# Altium project Sound_Pops.PrjPcb
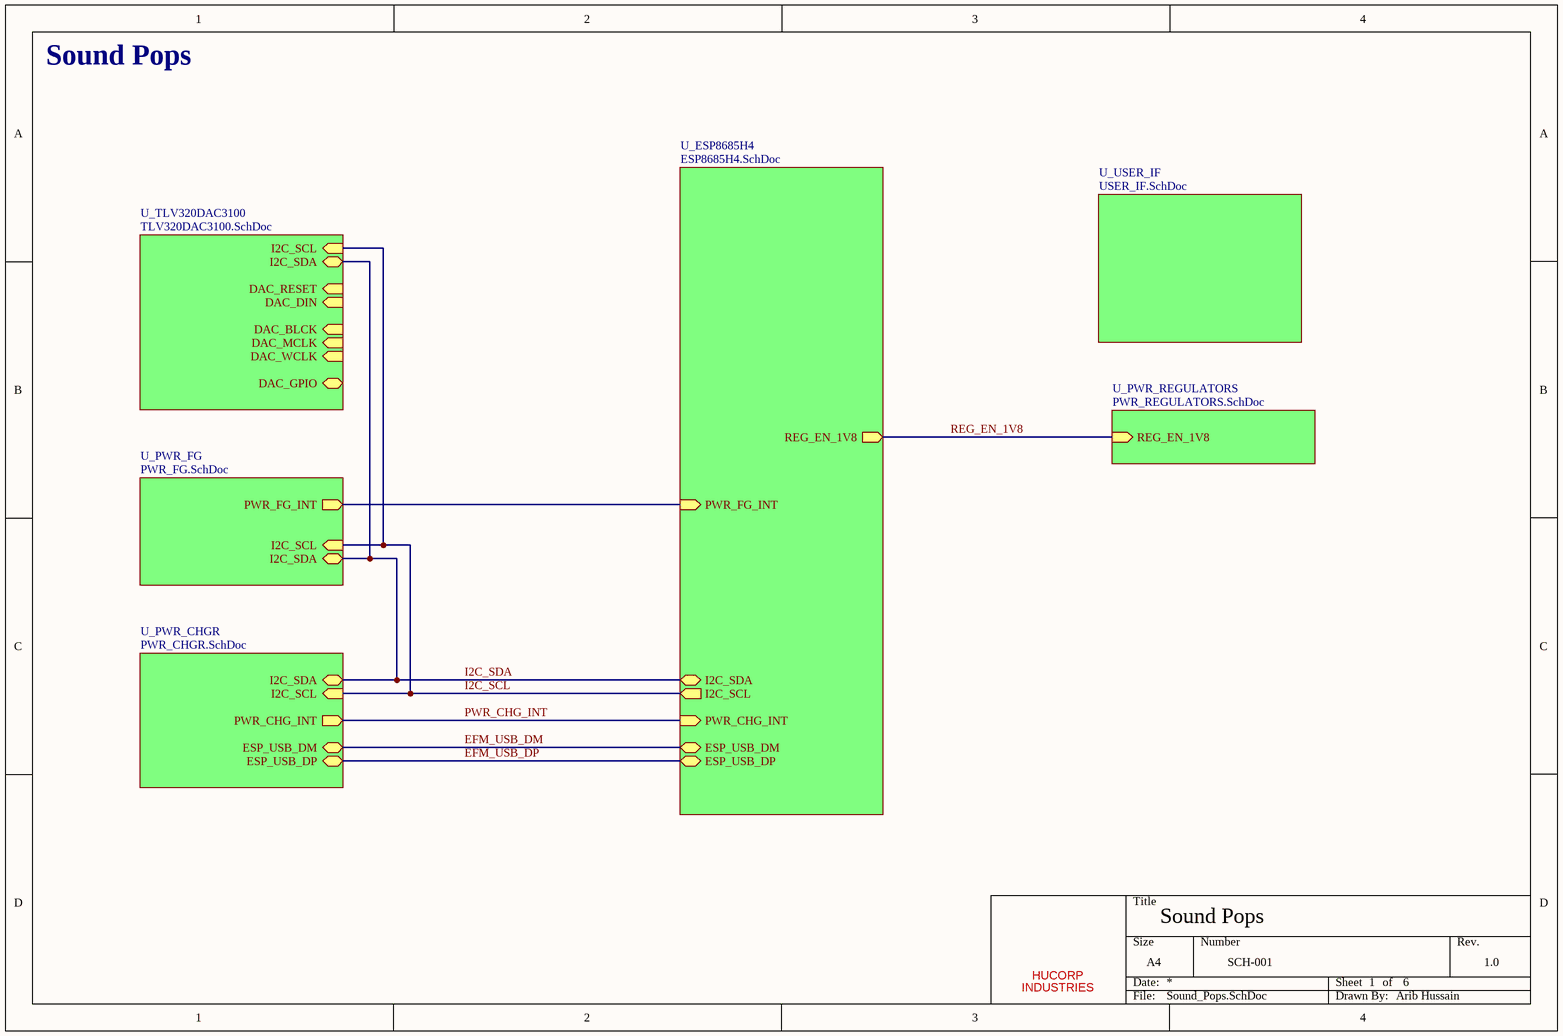
[diagram p0: Sound_Pops.SchDoc]
DrawnBy: Arib Hussain; Revision: 1.0; Title: Sound Pops
7 sheets, 82 parts. Net scope: hierarchical (ports join the sheet entries above them; power ports are global).
Sheets:
  Sound_Pops.SchDoc
    U_ESP8685H4 = ESP8685H4.SchDoc
    U_PWR_REGULATORS = PWR_REGULATORS.SchDoc
    U_USER_IF = USER_IF.SchDoc
    U_TLV320DAC3100 = TLV320DAC3100.SchDoc
    U_PWR_FG = PWR_FG.SchDoc
    U_PWR_CHGR = PWR_CHGR.SchDoc

## Sheet Sound_Pops.SchDoc: Sound Pops
size A4; SheetNumber: 1; SheetTotal: 6; DrawingNumber: SCH-001; SheetSize: A4

### Parts
(Parts that share a designator on the sheet are numbered #1, #2 ... from top to bottom, then left to right.)
*#1  HUCORP  (value not drawn)  (graphical)

### Sub-sheets
U_ESP8685H4 = ESP8685H4.SchDoc: ESP_USB_DM (bidir), ESP_USB_DP (bidir), I2C_SCL (out), I2C_SDA (bidir), PWR_CHG_INT (in), REG_EN_1V8 (out), PWR_FG_INT (in)
U_PWR_CHGR = PWR_CHGR.SchDoc: ESP_USB_DP (bidir), I2C_SCL (in), I2C_SDA (bidir), ESP_USB_DM (bidir), PWR_CHG_INT (out)
U_PWR_FG = PWR_FG.SchDoc: I2C_SDA (bidir), I2C_SCL (in), PWR_FG_INT (out)
U_PWR_REGULATORS = PWR_REGULATORS.SchDoc: REG_EN_1V8 (in)
U_TLV320DAC3100 = TLV320DAC3100.SchDoc: I2C_SDA (bidir), I2C_SCL (in), DAC_RESET (in), DAC_BLCK (in), DAC_DIN (in), DAC_MCLK (in), DAC_WCLK (in), DAC_GPIO (bidir)
U_USER_IF = USER_IF.SchDoc: no entries

### Nets
EFM_USB_DM: sheet U_ESP8685H4/ESP_USB_DM, sheet U_PWR_CHGR/ESP_USB_DM
EFM_USB_DP: sheet U_ESP8685H4/ESP_USB_DP, sheet U_PWR_CHGR/ESP_USB_DP
I2C_SCL: sheet U_ESP8685H4/I2C_SCL, sheet U_TLV320DAC3100/I2C_SCL, sheet U_PWR_FG/I2C_SCL, sheet U_PWR_CHGR/I2C_SCL
I2C_SDA: sheet U_ESP8685H4/I2C_SDA, sheet U_TLV320DAC3100/I2C_SDA, sheet U_PWR_FG/I2C_SDA, sheet U_PWR_CHGR/I2C_SDA
PWR_CHG_INT: sheet U_ESP8685H4/PWR_CHG_INT, sheet U_PWR_CHGR/PWR_CHG_INT
PWR_FG_INT: sheet U_ESP8685H4/PWR_FG_INT, sheet U_PWR_FG/PWR_FG_INT
REG_EN_1V8: sheet U_ESP8685H4/REG_EN_1V8, sheet U_PWR_REGULATORS/REG_EN_1V8  [project net 1V8_EN]

### Notes on the sheet
- Sound Pops
- (in symbol TitleBlock1) Title; Size; Number; Rev.; INDUSTRIES; Date:; Sheet; of; File:; Drawn By:

### Library data of the parts
*#1 = TitleBlock1: HUCORP Title Block

## Sheet ESP8685H4.SchDoc: Sound Pops
size A4; SheetNumber: 2; SheetTotal: 7; SheetSize: A4; DrawingNumber: SCH-001
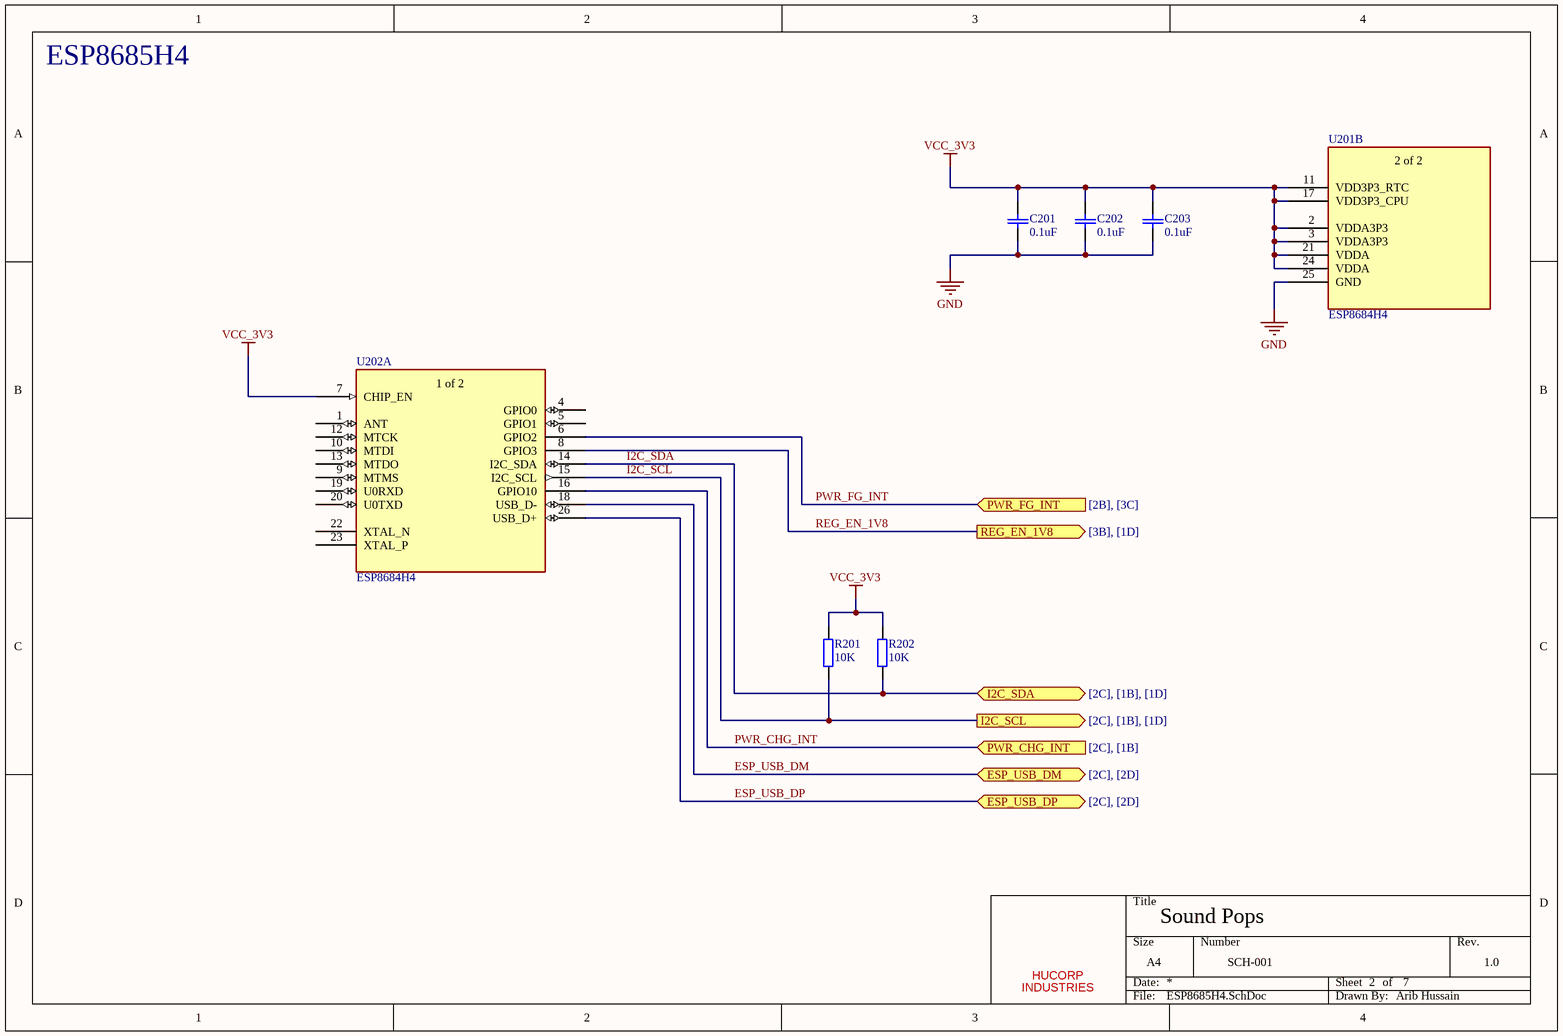
[diagram p1: ESP8685H4.SchDoc]

### Parts
(Parts that share a designator on the sheet are numbered #1, #2 ... from top to bottom, then left to right.)
*#2  HUCORP  (value not drawn)  (graphical)
C201  value 0.1uF  [CAP_CL10_SAM]  (hidden comment: 100 nF)
C202  value 0.1uF  [CAP_CL10_SAM]  (hidden comment: 100 nF)
C203  value 0.1uF  [CAP_CL10_SAM]  (hidden comment: 100 nF)
R201  10K  [RES_RC0603_YAG]
R202  10K  [RES_RC0603_YAG]
U201  ESP8684H4  [QFN24_4X4_EXP]  (part B of 2)
U202  ESP8684H4  [QFN24_4X4_EXP]  (part A of 2)

### Ports
ESP_USB_DM (bidir, see [2C], [2D]), ESP_USB_DP (bidir, see [2C], [2D]), I2C_SCL (out, see [2C], [1B], [1D]), I2C_SDA (bidir, see [2C], [1B], [1D]), PWR_CHG_INT (in, see [2C], [1B]), PWR_FG_INT (in, see [2B], [3C]), REG_EN_1V8 (out, see [3B], [1D])

### Nets
GND: C201.1 C202.1 C203.1 U201.25(GND)
VCC_3V3: C201.2 C202.2 C203.2 R201.2 R202.2 U201.2(VDDA3P3) U201.3(VDDA3P3) U201.11(VDD3P3_RTC) U201.17(VDD3P3_CPU) U201.21(VDDA) U201.24(VDDA) U202.7(CHIP_EN)
ESP_USB_DM: U202.18(USB_D-) ; port ESP_USB_DM  [project net EFM_USB_DM]
ESP_USB_DP: U202.26(USB_D+) ; port ESP_USB_DP  [project net EFM_USB_DP]
I2C_SCL: R201.1 U202.15(I2C_SCL) ; port I2C_SCL
I2C_SDA: R202.1 U202.14(I2C_SDA) ; port I2C_SDA
PWR_CHG_INT: U202.16(GPIO10) ; port PWR_CHG_INT
PWR_FG_INT: U202.6(GPIO2) ; port PWR_FG_INT
REG_EN_1V8: U202.8(GPIO3) ; port REG_EN_1V8  [project net 1V8_EN]

Not connected (* = marked no-connect by the designer): U202 1(ANT) 4(GPIO0) 5(GPIO1) 9(MTMS) 10(MTDI) 12(MTCK) 13(MTDO) 19(U0RXD) 20(U0TXD) 22(XTAL_N) 23(XTAL_P)

### Notes on the sheet
- ESP8685H4
- (in symbol ESP8684H4, part A) 1 of 2
- (in symbol ESP8684H4, part B) 2 of 2
- (in symbol TitleBlock1) Title; Size; Number; Rev.; INDUSTRIES; Date:; Sheet; of; File:; Drawn By:

### Library data of the parts
*#2 = TitleBlock1: HUCORP Title Block
C201-C203 = CL10B104KA8NNNC: CAP CER 0.1UF 25V X7R 0603; Mfr_Name: Samsung; Type: DEV; Copyright: Copyright (C) 2022 Ultra Librarian. All rights reserved.; Manufacturer_Part_Number: CL10B104KA8NNNC; Digi-Key_Part_Number_1: 1276-1006-2-ND; Digi-Key_Part_Number_2: 1276-1006-1-ND; Digi-Key_Part_Number_3: 1276-1006-6-ND; RefDes: RefDes
R201 R202 = RC0603JR-1310KL: RES 10K OHM 5% 1/10W 0603; Mfr_Name: Yageo; Copyright: Copyright (C) 2022 Ultra Librarian. All rights reserved.; Manufacturer_Part_Number: RC0603JR-1310KL; Digi-Key_Part_Number_1: 13-RC0603JR-1310KLTR-ND; Digi-Key_Part_Number_2: 13-RC0603JR-1310KLCT-ND; Digi-Key_Part_Number_3: 13-RC0603JR-1310KLDKR-ND; RefDes: RefDes; Type: DEV; Value: 10K
U201 U202 = ESP8684H4: IC RF TxRx + MCU Bluetooth, WiFi 802.11b/g/n, Bluetooth v5.0 2.4GHz 28-VFQFN Exposed Pad; Mfr_Name: Espressif Systems; Manufacturer_Part_Number: ESP8684H2; Copyright: Copyright (C) 2023 Ultra Librarian. All rights reserved.; RefDes: RefDes; Type: DEV

## Sheet PWR_REGULATORS.SchDoc: Sound Pops
size A4; SheetNumber: 5; SheetTotal: 7; DrawingNumber: 1.0; SheetSize: A4
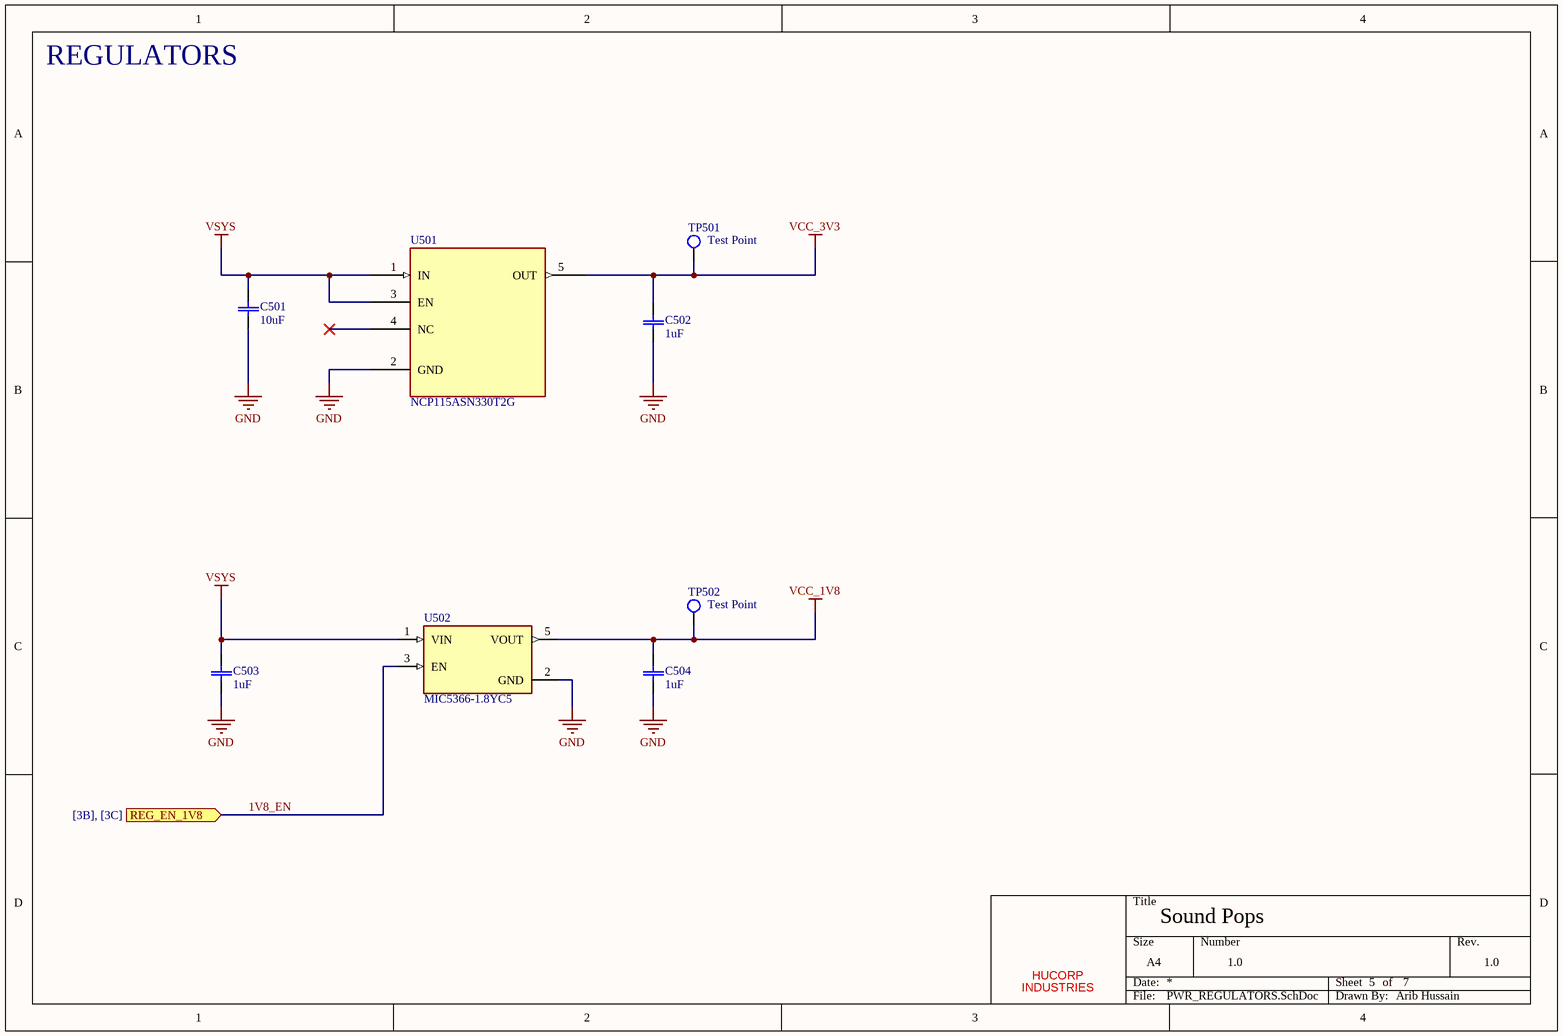
[diagram p2: PWR_REGULATORS.SchDoc]

### Parts
(Parts that share a designator on the sheet are numbered #1, #2 ... from top to bottom, then left to right.)
*#3  HUCORP  (value not drawn)  (graphical)
C501  value 10uF  [CAP_CL10_SAM]  (hidden comment: 10 uF)
C502  1uF  [CAP_CL10_SAM]
C503  1uF  [CAP_CL10_SAM]
C504  1uF  [CAP_CL10_SAM]
TP501  Test Point  [TestPoint1]  (no BOM)
TP502  Test Point  [TestPoint1]  (no BOM)
U501  NCP115ASN330T2G  [TSOP-5-483-N_ONS]
U502  MIC5366-1.8YC5  [SOT65P210X110-5N]

### Ports
REG_EN_1V8 (in, see [3B], [3C])

### Nets
GND: C501.1 C502.1 C503.1 C504.1 U501.2(GND) U502.2(GND)
VCC_1V8: C504.2 TP502.1 U502.5(VOUT)
VCC_3V3: C502.2 TP501.1 U501.5(OUT)
VSYS: C501.2 C503.2 U501.1(IN) U501.3(EN) U502.1(VIN)
1V8_EN: U502.3(EN) ; port REG_EN_1V8

Not connected (* = marked no-connect by the designer): U501 4(NC)*

### Notes on the sheet
- REGULATORS
- (in symbol TitleBlock1) Title; Size; Number; Rev.; INDUSTRIES; Date:; Sheet; of; File:; Drawn By:

### Library data of the parts
*#3 = TitleBlock1: HUCORP Title Block
C501 = CL10A106MQ8NNNC: 10 µF ±20% 6.3V Ceramic Capacitor X5R 0603 (1608 Metric); Mfr_Name: Samsung; Type: DEV; Copyright: Copyright (C) 2022 Ultra Librarian. All rights reserved.; Manufacturer_Part_Number: CL10A106MQ8NNNC; Digi-Key_Part_Number_1: 1276-1119-2-ND; Digi-Key_Part_Number_2: 1276-1119-1-ND; Digi-Key_Part_Number_3: 1276-1119-6-ND; RefDes: RefDes
C502-C504 = CL10A105KA8NNNC: CAP CER 1UF 25V X5R 0603; Mfr_Name: Samsung; Manufacturer_Part_Number: CL10B104KA8NNNC; Type: DEV; Copyright: Copyright (C) 2022 Ultra Librarian. All rights reserved.; Digi-Key_Part_Number_1: 1276-1006-2-ND; Digi-Key_Part_Number_2: 1276-1006-1-ND; Digi-Key_Part_Number_3: 1276-1006-6-ND; RefDes: RefDes; Value: 1uF
TP501 TP502 = TestPoint1: General Test Point
U501 = NCP115ASN330T2G: Linear Voltage Regulator IC Positive Fixed 1 Output 300mA 5-TSOP; Mfr_Name: onsemi; Copyright: Copyright (C) 2022 Ultra Librarian. All rights reserved.; Manufacturer_Part_Number: NCP115ASN330T2G; Digi-Key_Part_Number_1: NCP115ASN330T2GOSTR-ND; Digi-Key_Part_Number_2: NCP115ASN330T2GOSCT-ND; Digi-Key_Part_Number_3: NCP115ASN330T2GOSDKR-ND; Digi-Key_Part_Number_4: 2156-NCP115ASN330T2G-OS-ND; RefDes: RefDes; Type: DEV
U502 = MIC5366-1.8YC5-TR: Linear Voltage Regulator IC Positive Fixed 1 Output 150mA SC-70-5; MF: Microchip; SnapEDA_Link: https://www.snapeda.com/parts/MIC5366-1.8YC5-TR/Microchip/view-part/?ref=snap; Package: SC-70-5 Microchip; MP: MIC5366-1.8YC5-TR; Check_prices: https://www.snapeda.com/parts/MIC5366-1.8YC5-TR/Microchip/view-part/?ref=eda; Purchase-URL: https://pricing.snapeda.com/search/part/MIC5366-1.8YC5-TR/?ref=eda; Digi-Key_Part_Number: 576-3203-2-ND; Value: *

## Sheet USER_IF.SchDoc: Sound Pops
size A4; SheetNumber: 4; SheetTotal: 7; SheetSize: A4; DrawingNumber: SCH-001
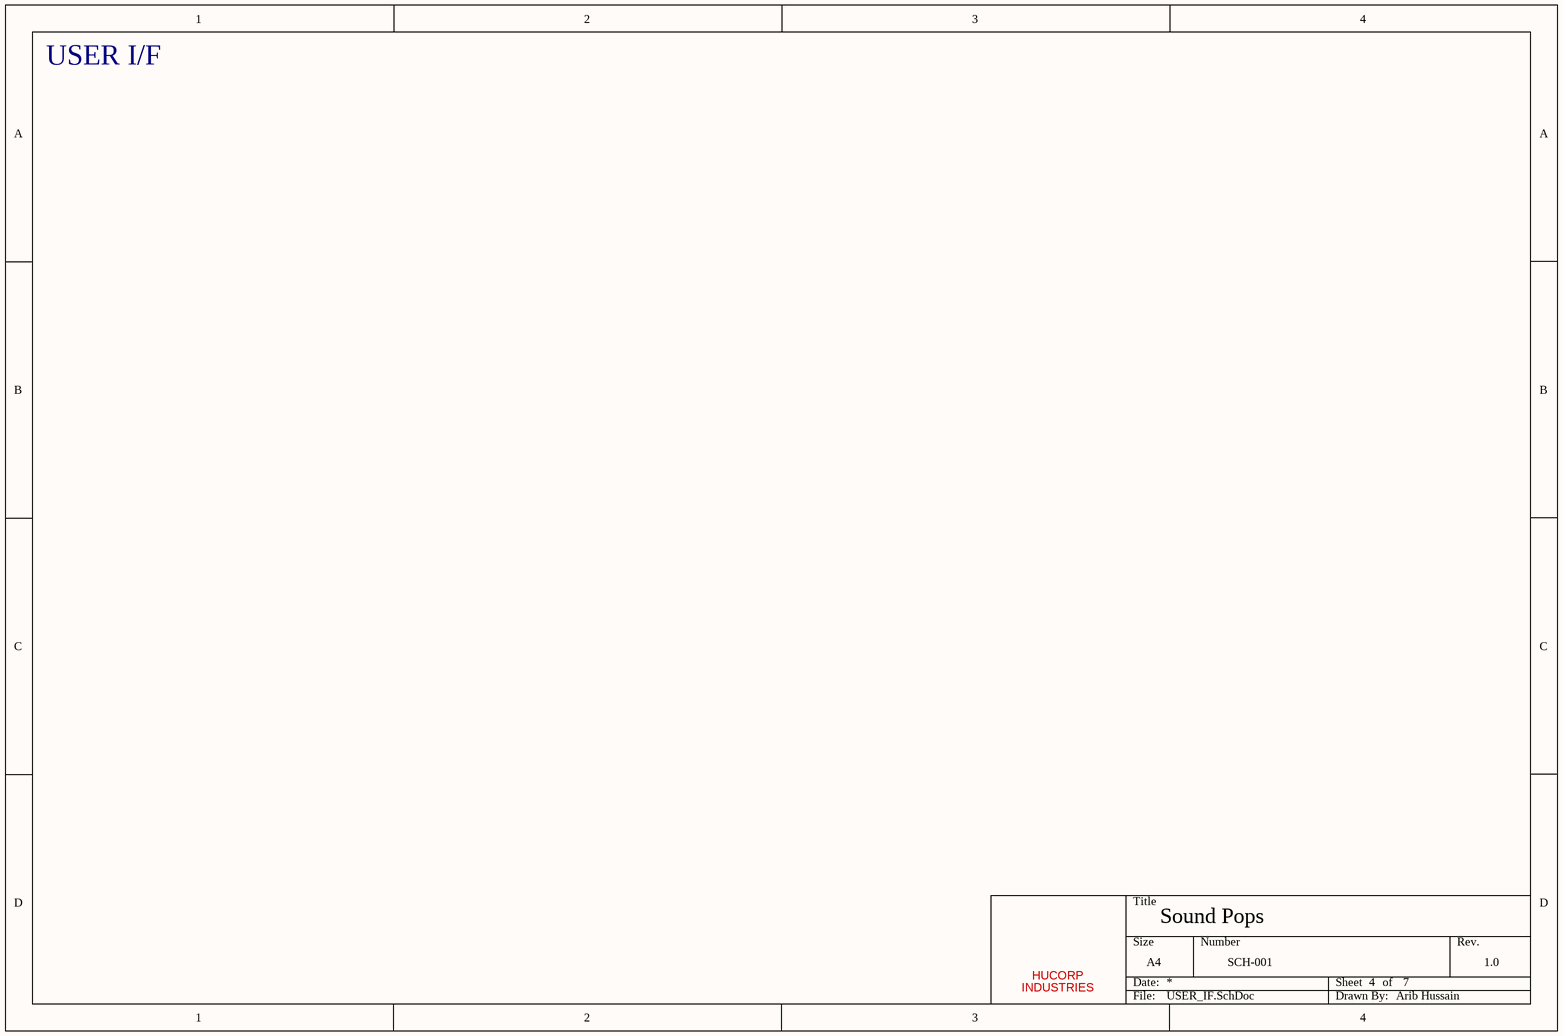
[diagram p3: USER_IF.SchDoc]

### Parts
(Parts that share a designator on the sheet are numbered #1, #2 ... from top to bottom, then left to right.)
*#4  HUCORP  (value not drawn)  (graphical)

### Notes on the sheet
- USER I/F
- (in symbol TitleBlock1) Title; Size; Number; Rev.; INDUSTRIES; Date:; Sheet; of; File:; Drawn By:

### Library data of the parts
*#4 = TitleBlock1: HUCORP Title Block

## Sheet TLV320DAC3100.SchDoc: Sound Pops
size A4; SheetNumber: 3; SheetTotal: 7; SheetSize: A4; DrawingNumber: SCH-001
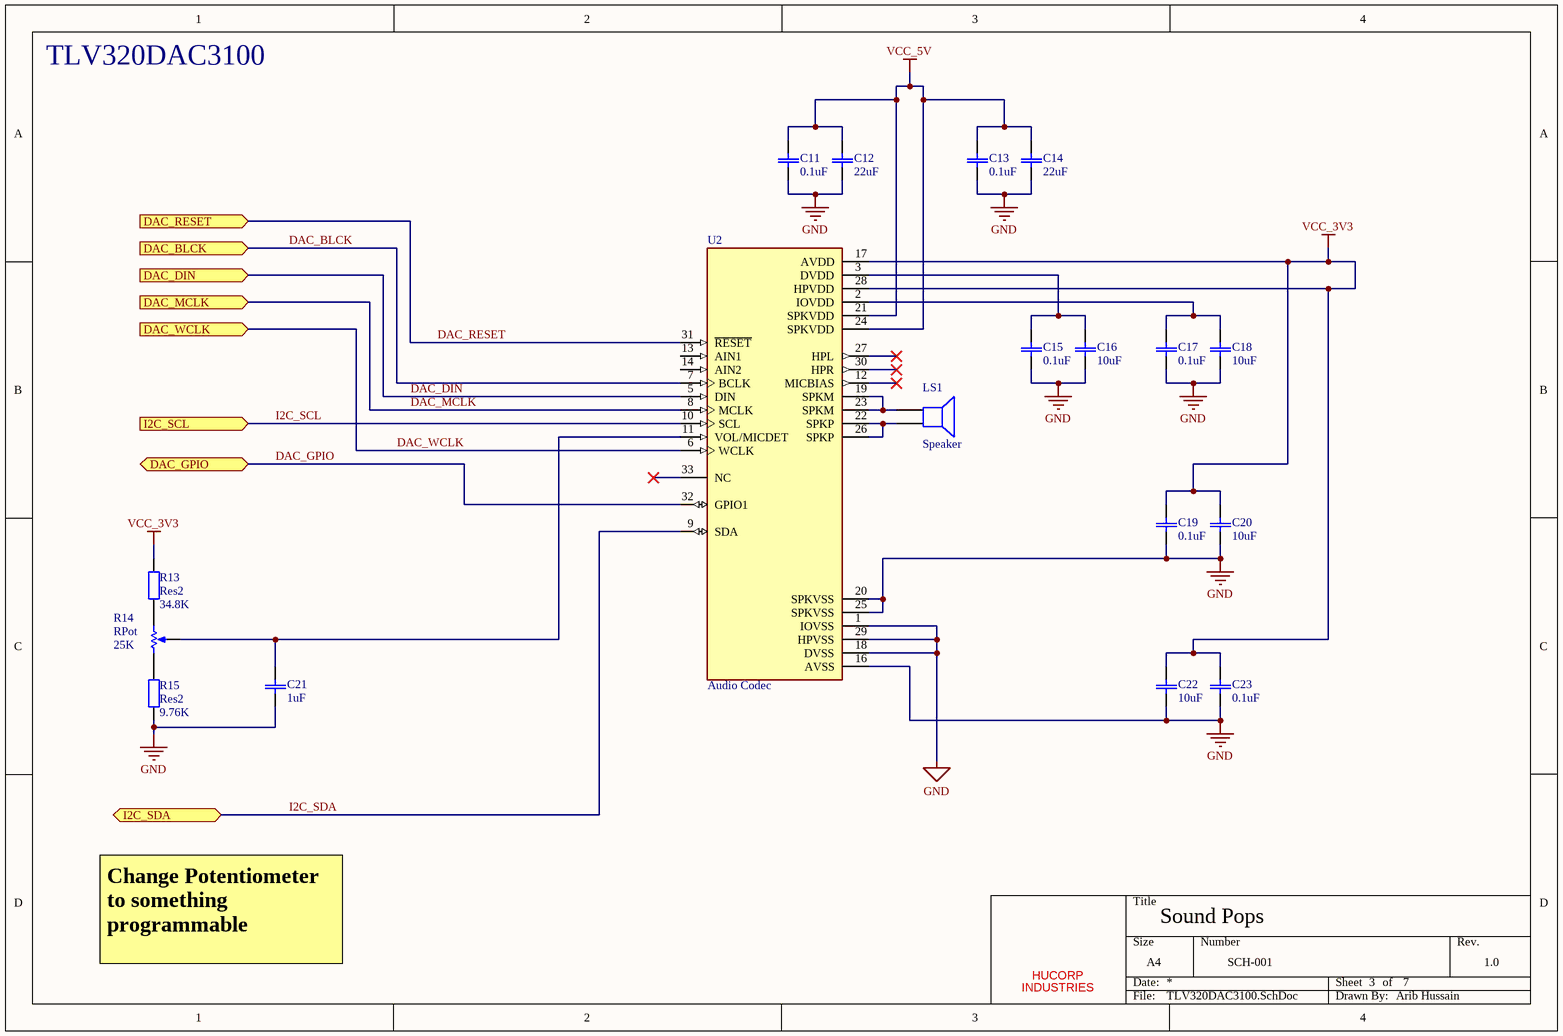
[diagram p4: TLV320DAC3100.SchDoc]

### Parts
(Parts that share a designator on the sheet are numbered #1, #2 ... from top to bottom, then left to right.)
*#5  HUCORP  (value not drawn)  (graphical)
C11  value 0.1uF  [CAP_CL10_SAM]  (hidden comment: 100 nF)
C12  value 22uF  [CAP_CL10_SAM]  (hidden comment: CL10A226MP8NUNE)
C13  value 0.1uF  [CAP_CL10_SAM]  (hidden comment: 100 nF)
C14  value 22uF  [CAP_CL10_SAM]  (hidden comment: CL10A226MP8NUNE)
C15  value 0.1uF  [CAP_CL10_SAM]  (hidden comment: 100 nF)
C16  value 10uF  [CAP_CL10_SAM]  (hidden comment: 10 uF)
C17  value 0.1uF  [CAP_CL10_SAM]  (hidden comment: 100 nF)
C18  value 10uF  [CAP_CL10_SAM]  (hidden comment: 10 uF)
C19  value 0.1uF  [CAP_CL10_SAM]  (hidden comment: 100 nF)
C20  value 10uF  [CAP_CL10_SAM]  (hidden comment: 10 uF)
C21  1uF  [CAP_CL10_SAM]
C22  value 10uF  [CAP_CL10_SAM]  (hidden comment: 10 uF)
C23  value 0.1uF  [CAP_CL10_SAM]  (hidden comment: 100 nF)
LS1  Speaker  [PIN2]
R13  Res2  value 34.8K  [AXIAL-0.4]
R14  RPot  value 25K  [VR5]
R15  Res2  value 9.76K  [AXIAL-0.4]
U2  Audio Codec  [IC_ADS125H01IRHBT]

### Ports
DAC_BLCK (in), DAC_DIN (in), DAC_GPIO (bidir), DAC_MCLK (in), DAC_RESET (in), DAC_WCLK (in), I2C_SCL (in), I2C_SDA (bidir)

### Nets
GND: C11.1 C12.1 C13.1 C14.1 C15.1 C16.1 C17.1 C18.1 C19.1 C20.1 C21.1 C22.1 C23.1 R15.1 U2.1(IOVSS) U2.16(AVSS) U2.18(DVSS) U2.20(SPKVSS) U2.25(SPKVSS) U2.29(HPVSS)
VCC_3V3: C19.2 C20.2 C22.2 C23.2 R13.2 U2.17(AVDD) U2.28(HPVDD)
VCC_5V: C11.2 C12.2 C13.2 C14.2 U2.21(SPKVDD) U2.24(SPKVDD)
DAC_BLCK: U2.7(BCLK) ; port DAC_BLCK
DAC_DIN: U2.5(DIN) ; port DAC_DIN
DAC_GPIO: U2.32(GPIO1) ; port DAC_GPIO
DAC_MCLK: U2.8(MCLK) ; port DAC_MCLK
DAC_RESET: U2.31(~{RESET}) ; port DAC_RESET
DAC_WCLK: U2.6(WCLK) ; port DAC_WCLK
I2C_SCL: U2.10(SCL) ; port I2C_SCL
I2C_SDA: U2.9(SDA) ; port I2C_SDA
NetC15_2: C15.2 C16.2 U2.3(DVDD)
NetC17_2: C17.2 C18.2 U2.2(IOVDD)
NetC21_2: C21.2 R14.3(TAP) U2.11(VOL/MICDET)
NetLS1_1: LS1.1 U2.19(SPKM) U2.23(SPKM)
NetLS1_2: LS1.2 U2.22(SPKP) U2.26(SPKP)
NetR13_1: R13.1 R14.2(BOT)
NetR14_1: R14.1(TOP) R15.2

Not connected (* = marked no-connect by the designer): U2 12(MICBIAS)* 13(AIN1) 14(AIN2) 27(HPL)* 30(HPR)* 33(NC)*

### Notes on the sheet
- TLV320DAC3100
- Change Potentiometer to something programmable
- (in symbol TitleBlock1) Title; Size; Number; Rev.; INDUSTRIES; Date:; Sheet; of; File:; Drawn By:

### Library data of the parts
*#5 = TitleBlock1: HUCORP Title Block
C11 C13 C15 C17 C19 C23 = CL10B104KA8NNNC: as C201 on sheet ESP8685H4; Copyright: Copyright (C) 2022 Ultra Librarian. All rights reserved.; Manufacturer_Part_Number: CL10B104KA8NNNC; Digi-Key_Part_Number_1: 1276-1006-2-ND; Digi-Key_Part_Number_2: 1276-1006-1-ND; Digi-Key_Part_Number_3: 1276-1006-6-ND; RefDes: RefDes
C12 C14 = CL10A226MP8NUNE: CAP CER 22UF 10V X5R 0603; Mfr_Name: Samsung; Type: DEV; Copyright: Copyright (C) 2023 Ultra Librarian. All rights reserved.; Manufacturer_Part_Number: CL10A226MP8NUNE; Digi-Key_Part_Number_1: 1276-1274-2-ND; Digi-Key_Part_Number_2: 1276-1274-1-ND; Digi-Key_Part_Number_3: 1276-1274-6-ND; RefDes: RefDes
C16 C18 C20 C22 = CL10A106MQ8NNNC: as C501 on sheet PWR_REGULATORS; Copyright: Copyright (C) 2022 Ultra Librarian. All rights reserved.; Manufacturer_Part_Number: CL10A106MQ8NNNC; Digi-Key_Part_Number_1: 1276-1119-2-ND; Digi-Key_Part_Number_2: 1276-1119-1-ND; Digi-Key_Part_Number_3: 1276-1119-6-ND; RefDes: RefDes
C21 = CL10A105KA8NNNC: as C502 on sheet PWR_REGULATORS; Copyright: Copyright (C) 2022 Ultra Librarian. All rights reserved.; Digi-Key_Part_Number_1: 1276-1006-2-ND; Digi-Key_Part_Number_2: 1276-1006-1-ND; Digi-Key_Part_Number_3: 1276-1006-6-ND; RefDes: RefDes; Value: 1uF
LS1 = Speaker: Loudspeaker; Published: 24-Mar-1999; LatestRevisionDate: 17-Jul-2002; LatestRevisionNote: Re-released for DXP Platform.; PackageReference: PIN2; Publisher: Altium Limited
R13 R15 = Res2: Resistor; Published: 8-Jun-2000; LatestRevisionDate: 17-Jul-2002; LatestRevisionNote: Re-released for DXP Platform.; PackageReference: AXIAL-0.4; Publisher: Altium Limited; PackageDescription: Axial Device, Thru-Hole; 2 Leads; 0.4 in Pin Spacing
R14 = RPot: Potentiometer; Sim Note: Enter the Resistance value and the set point into parameter fields.; Set Position: 0.5; Published: 8-Jun-2000; LatestRevisionDate: 17-Jul-2002; LatestRevisionNote: Re-released for DXP Platform.; PackageReference: VR5; Publisher: Altium Limited; PackageDescription: Variable Resistor, Thru-Hole; 3 Leads
U2 = TLV320DAC3100IRHBT: Low-Power Stereo Audio DAC With Mono Class-D Speaker Amplifier 32-VQFN -40 to 85; MF: Texas Instruments; Check_prices: https://www.snapeda.com/parts/TLV320DAC3100IRHBT/Texas%20Instruments/view-part/1191598/?ref=eda; Value: *; Purchase-URL: https://pricing.snapeda.com/search/part/TLV320DAC3100IRHBT/?ref=eda; Package: VQFN-32 Texas Instruments; Digi-Key_Part_Number: 296-39266-1-ND; MP: TLV320DAC3100IRHBT; SnapEDA_Link: https://www.snapeda.com/parts/TLV320DAC3100IRHBT/Texas%20Instruments/view-part/1191598/?ref=snap

## Sheet PWR_FG.SchDoc: Sound Pops
size A4; SheetNumber: 7; SheetTotal: 6; DrawingNumber: SCH-001; SheetSize: A4
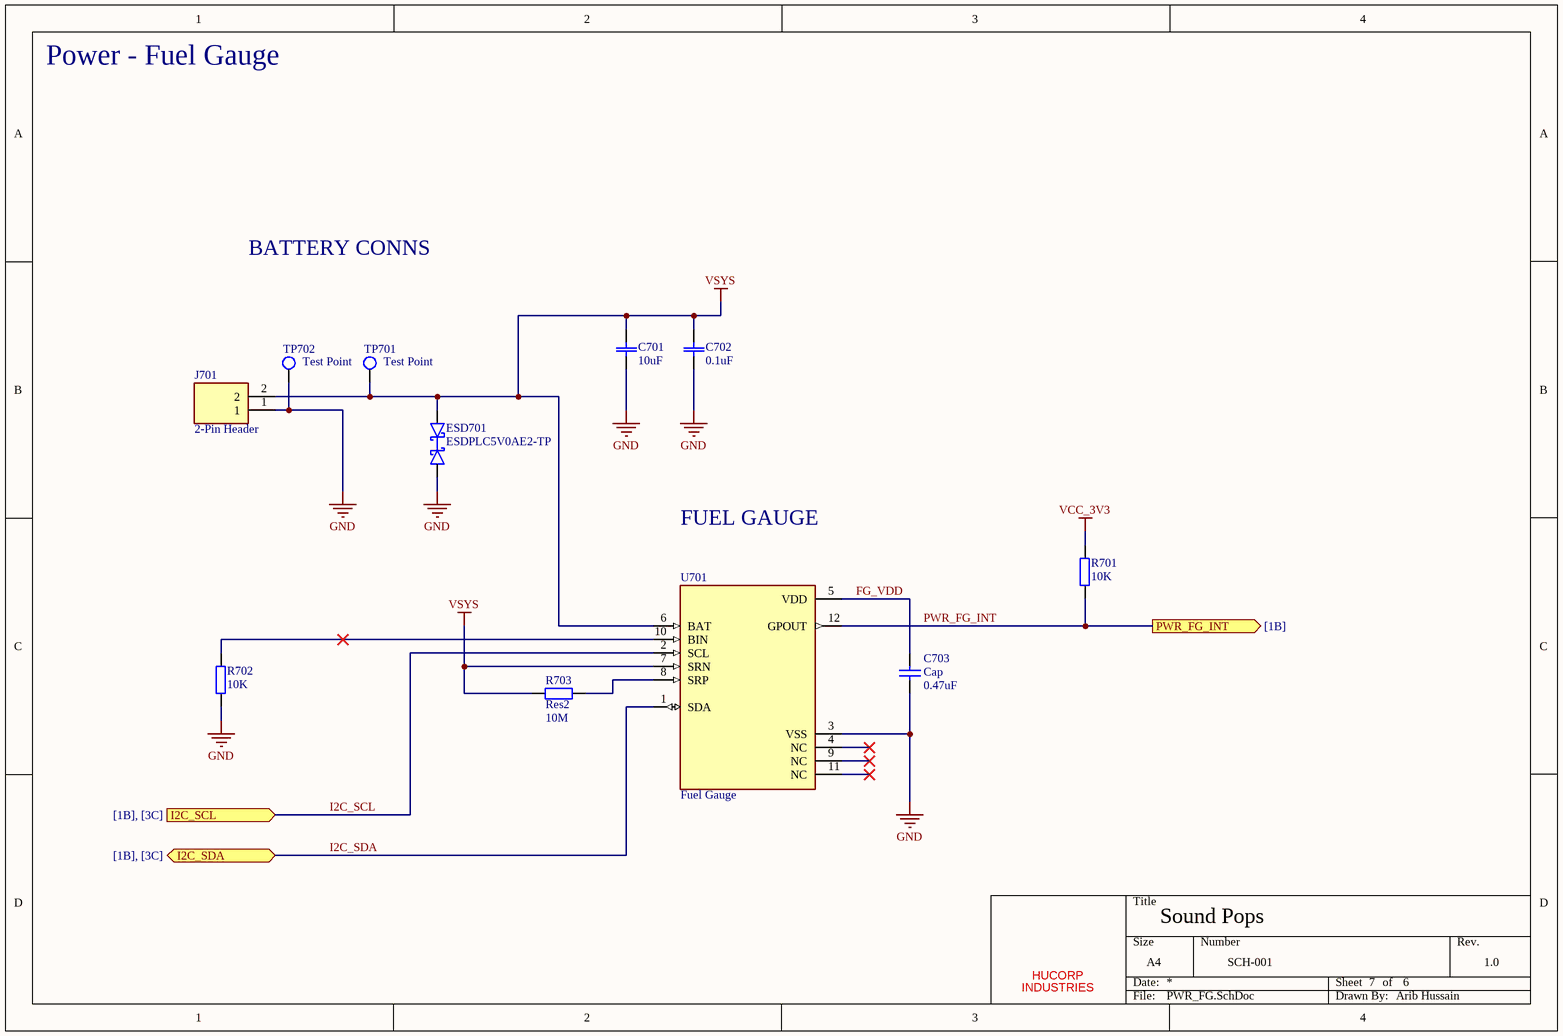
[diagram p5: PWR_FG.SchDoc]

### Parts
(Parts that share a designator on the sheet are numbered #1, #2 ... from top to bottom, then left to right.)
*#6  HUCORP  (value not drawn)  (graphical)
C701  value 10uF  [CAP_CL10_SAM]  (hidden comment: 10 uF)
C702  value 0.1uF  [CAP_CL10_SAM]  (hidden comment: 100 nF)
C703  Cap  value 0.47uF  [RAD-0.3]
ESD701  ESDPLC5V0AE2-TP  [ESDPLC5V0AE2]
J701  2-Pin Header  [TE_2-644861-2]
R701  10K  [RES_RC0603_YAG]
R702  10K  [RES_RC0603_YAG]
R703  Res2  value 10M  [AXIAL-0.4]
TP701  Test Point  [TestPoint1]  (no BOM)
TP702  Test Point  [TestPoint1]  (no BOM)
U701  Fuel Gauge  [IC_BQ27441DRZR-G1A]

### Ports
I2C_SCL (in, see [1B], [3C]), I2C_SDA (bidir, see [1B], [3C]), PWR_FG_INT (out, see [1B])

### Nets
GND: C701.1 C702.1 C703.1 ESD701.2 J701.1 R702.1 TP702.1 U701.3(VSS)
VCC_3V3: R701.2
VSYS: C701.2 C702.2 ESD701.1 J701.2 R703.2 TP701.1 U701.6(BAT) U701.7(SRN)
FG_VDD: C703.2 U701.5(VDD)
I2C_SCL: U701.2(SCL) ; port I2C_SCL
I2C_SDA: U701.1(SDA) ; port I2C_SDA
PWR_FG_INT: R701.1 U701.12(GPOUT) ; port PWR_FG_INT
NetR702_2: R702.2 U701.10(BIN)
NetR703_1: R703.1 U701.8(SRP)

Not connected (* = marked no-connect by the designer): U701 4(NC)* 9(NC)* 11(NC)*

### Notes on the sheet
- Power - Fuel Gauge
- BATTERY CONNS
- FUEL GAUGE
- (in symbol TitleBlock1) Title; Size; Number; Rev.; INDUSTRIES; Date:; Sheet; of; File:; Drawn By:

### Library data of the parts
*#6 = TitleBlock1: HUCORP Title Block
C701 = CL10A106MQ8NNNC: as C501 on sheet PWR_REGULATORS; Copyright: Copyright (C) 2022 Ultra Librarian. All rights reserved.; Manufacturer_Part_Number: CL10A106MQ8NNNC; Digi-Key_Part_Number_1: 1276-1119-2-ND; Digi-Key_Part_Number_2: 1276-1119-1-ND; Digi-Key_Part_Number_3: 1276-1119-6-ND; RefDes: RefDes
C702 = CL10B104KA8NNNC: as C201 on sheet ESP8685H4; Copyright: Copyright (C) 2022 Ultra Librarian. All rights reserved.; Manufacturer_Part_Number: CL10B104KA8NNNC; Digi-Key_Part_Number_1: 1276-1006-2-ND; Digi-Key_Part_Number_2: 1276-1006-1-ND; Digi-Key_Part_Number_3: 1276-1006-6-ND; RefDes: RefDes
C703 = Cap: Capacitor; Published: 8-Jun-2000; LatestRevisionDate: 17-Jul-2002; LatestRevisionNote: Re-released for DXP Platform.; PackageReference: RAD-0.3; Publisher: Altium Limited; PackageDescription: Radial Cap, Thru-Hole; 2 Leads; 0.3 in Pin Spacing
ESD701 = ESDPLC5V0AE2-TP: TVS DIODE 5.5VWM 15VC 0201-A
J701 = 2-644861-2: 02P MTA100 SHRD HDR,W/O PEG SN; Number_of_Positions: 2; Centerline_Pitch: 2.54 mm[.1 in]; Product_Type: Connector; MF: TE Connectivity; Value: *; SnapEDA_Link: https://www.snapeda.com/parts/2-644861-2/TE+Connectivity+AMP+Connectors/view-part/?ref=snap; MP: 2-644861-2; Package: None; Check_prices: https://www.snapeda.com/parts/2-644861-2/TE+Connectivity+AMP+Connectors/view-part/?ref=eda; Digi-Key_Part_Number: A30931-ND; Purchase-URL: https://pricing.snapeda.com/search/part/2-644861-2/?ref=eda
R701 R702 = RC0603JR-1310KL: as R201 on sheet ESP8685H4; Copyright: Copyright (C) 2022 Ultra Librarian. All rights reserved.; Manufacturer_Part_Number: RC0603JR-1310KL; Digi-Key_Part_Number_1: 13-RC0603JR-1310KLTR-ND; Digi-Key_Part_Number_2: 13-RC0603JR-1310KLCT-ND; Digi-Key_Part_Number_3: 13-RC0603JR-1310KLDKR-ND; RefDes: RefDes; Type: DEV; Value: 10K
R703 = Res2: Resistor; Published: 8-Jun-2000; LatestRevisionDate: 17-Jul-2002; LatestRevisionNote: Re-released for DXP Platform.; PackageReference: AXIAL-0.4; Publisher: Altium Limited; PackageDescription: Axial Device, Thru-Hole; 2 Leads; 0.4 in Pin Spacing
TP701 TP702 = TestPoint1: General Test Point
U701 = BQ27441DRZR-G1A: System-side Impedance Track battery fuel (gas) gauge 12-SON -40 to 85; MF: Texas Instruments; Value: *; SnapEDA_Link: https://www.snapeda.com/parts/BQ27441DRZR-G1A/Texas%20Instruments/view-part/331244/?ref=snap; MP: BQ27441DRZR-G1A; Package: VSON-12 Texas Instruments; Check_prices: https://www.snapeda.com/parts/BQ27441DRZR-G1A/Texas%20Instruments/view-part/331244/?ref=eda; Digi-Key_Part_Number: 296-39941-1-ND; Purchase-URL: https://pricing.snapeda.com/search/part/BQ27441DRZR-G1A/?ref=eda

## Sheet PWR_CHGR.SchDoc: Sound Pops
size A4; SheetNumber: 6; SheetTotal: 6; SheetSize: A4; DrawingNumber: SCH-002; SPICEModelCacheCAOXICTU: <root> / <DocumentId>CAOXICTU</DocumentId> / <CacheFrame Number="0"> / <Model Name="led0" Kind="MDL"> / <Text>*Typ INFRARED GaAs LED: Vf=1.2V Vr=5V If=40mA trr=3uS / *LED Pinout: 1=A, 2=K / .MODEL LED0 D (IS=93.5P RS=84M N=2.63 BV=5 IBV=10U / + CJO=2.97P VJ=.75 M=.333 TT=4.32U)</Text> / </Model> / </CacheFrame> / </root>
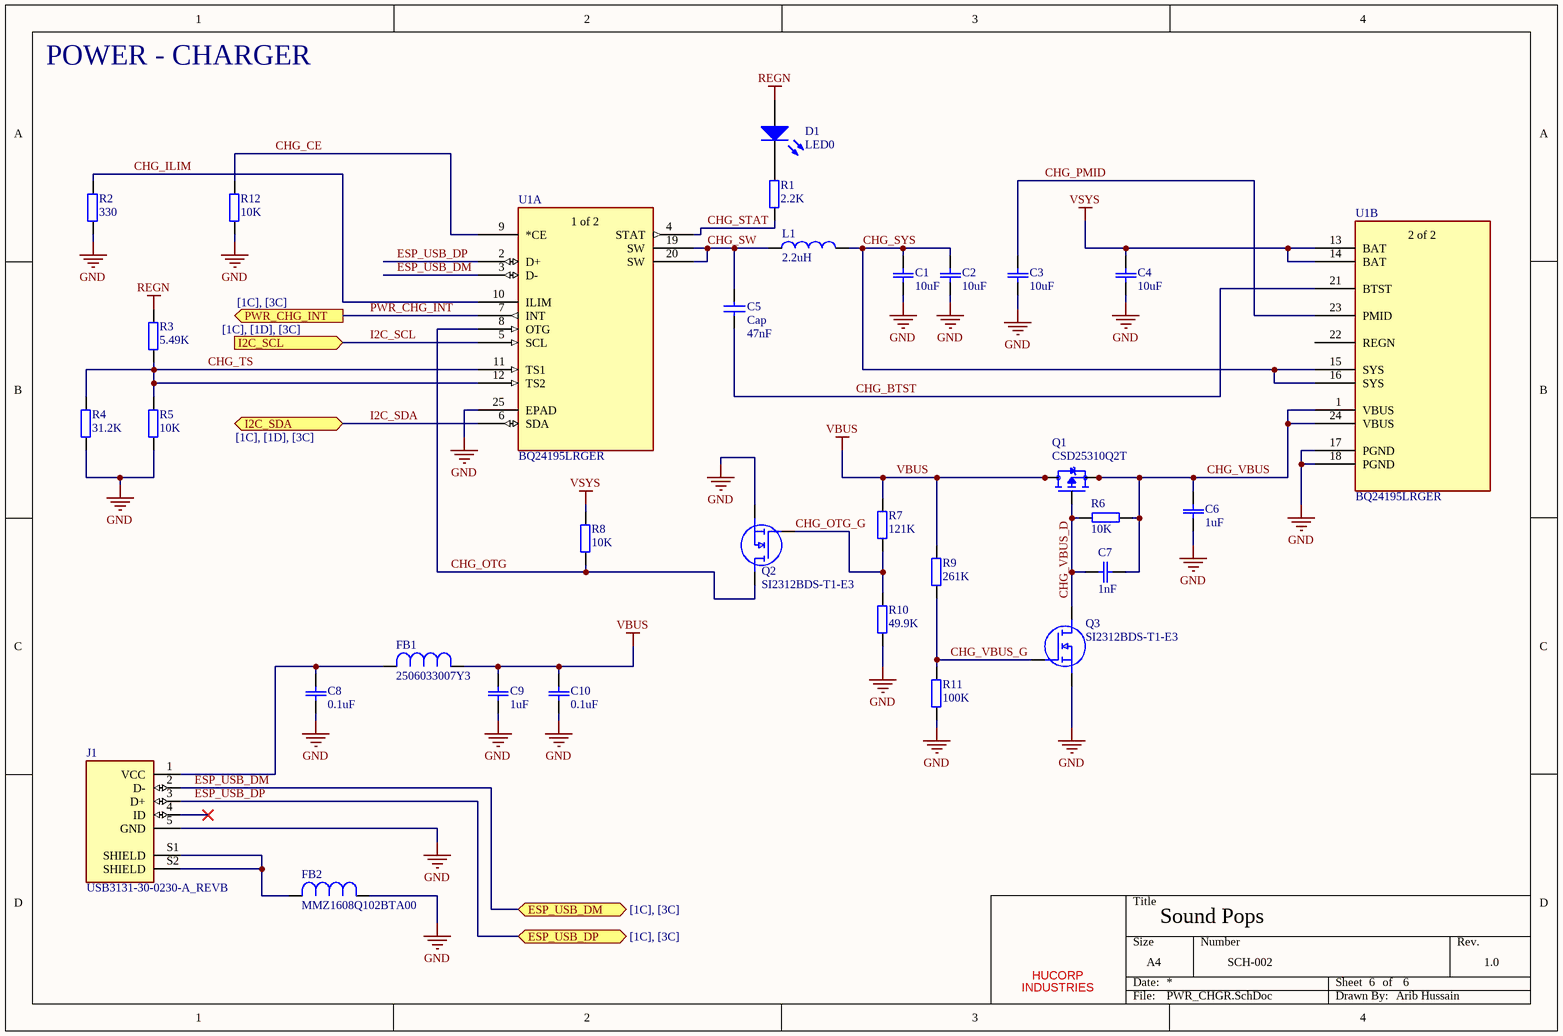
[diagram p6: PWR_CHGR.SchDoc]

### Parts
(Parts that share a designator on the sheet are numbered #1, #2 ... from top to bottom, then left to right.)
*#7  HUCORP  (value not drawn)  (graphical)
C1  value 10uF  [CAP_CL10_SAM]  (hidden comment: 10 uF)
C2  value 10uF  [CAP_CL10_SAM]  (hidden comment: 10 uF)
C3  value 10uF  [CAP_CL10_SAM]  (hidden comment: 10 uF)
C4  value 10uF  [CAP_CL10_SAM]  (hidden comment: 10 uF)
C5  Cap  value 47nF  [RAD-0.3]
C6  1uF  [CAP_CL10_SAM]
C7  value 1nF  [CAP_CL10_SAM]  (hidden comment: 1 nF)
C8  value 0.1uF  [CAP_CL10_SAM]  (hidden comment: 100 nF)
C9  1uF  [CAP_CL10_SAM]
C10  value 0.1uF  [CAP_CL10_SAM]  (hidden comment: 100 nF)
D1  LED0  [LED-0]
FB1  2506033007Y3  [IND_25_0603_FRT]
FB2  MMZ1608Q102BTA00  [IND_1608_TDK]
J1  USB3131-30-0230-A_REVB  [GCT_USB3131-30-0230-A_REVB]
L1  value 2.2uH  [INDC2520X100N]  (hidden comment: DFE252010P-2R2M=P2)
Q1  CSD25310Q2T  [TRANS_CSD25310Q2T]
Q2  SI2312BDS-T1-E3  [SOT95P237X112-3N]
Q3  SI2312BDS-T1-E3  [SOT95P237X112-3N]
R1  value 2.2K  [RC0603N_YAG]  (hidden comment: RC0603FR-072K2L)
R2  value 330  [RES_RC0603_YAG]  (hidden comment: RC0603FR-13330RL)
R3  value 5.49K  [RC0603N_YAG]  (hidden comment: RC0603FR-075K49L)
R4  value 31.2K  [RESC1608X55N]  (hidden comment: RT0603DRE0731K2L)
R5  10K  [RES_RC0603_YAG]
R6  10K  [RES_RC0603_YAG]
R7  value 121K  [RC0603N_YAG]  (hidden comment: RC0603FR-07121KL)
R8  10K  [RES_RC0603_YAG]
R9  value 261K  [RC0603N_YAG]  (hidden comment: RC0603FR-07261KL)
R10  value 49.9K  [RES_RC0603_YAG]  (hidden comment: RC0603FR-1049K9L)
R11  100K  [RC0603N_YAG]
R12  10K  [RES_RC0603_YAG]
U1  BQ24195LRGER  [RGE24_2P7X2P7_TEX]  (parts A,B of 2)

### Ports
ESP_USB_DM (bidir, see [1C], [3C]), ESP_USB_DP (bidir, see [1C], [3C]), I2C_SCL (in, see [1C], [1D], [3C]), I2C_SDA (bidir, see [1C], [1D], [3C]), PWR_CHG_INT (out, see [1C], [3C])

### Nets
GND: C1.1 C2.1 C3.1 C4.1 C6.1 C8.1 C9.1 C10.1 FB2.1 J1.5(GND) Q2.2(S) Q3.2(S) R2.1 R4.1 R5.1 R10.1 R11.1 R12.1 U1.17(PGND) U1.18(PGND) U1.25(EPAD)
REGN: D1.1(A) R3.2
VBUS: C9.2 C10.2 FB1.1 Q1.4(D) Q1.8(D) R7.2 R9.2
VSYS: C4.2 R8.2 U1.13(BAT) U1.14(BAT)
CHG_BTST: C5.1 U1.21(BTST)
CHG_CE: R12.2 U1.9(*CE)
CHG_ILIM: R2.2 U1.10(ILIM)
CHG_OTG: Q2.3(D) R8.1 U1.8(OTG)
CHG_OTG_G: Q2.1(G) R7.1 R10.2
CHG_PMID: C3.2 U1.23(PMID)
CHG_STAT: R1.1 U1.4(STAT)
CHG_SW: C5.2 L1.1 U1.19(SW) U1.20(SW)
CHG_SYS: C1.2 C2.2 L1.2 U1.15(SYS) U1.16(SYS)
CHG_TS: R3.1 R4.2 R5.2 U1.11(TS1) U1.12(TS2)
CHG_VBUS: C6.2 C7.2 Q1.1(S) Q1.2(S) Q1.5(S) Q1.6(S) Q1.7(S) R6.2 U1.1(VBUS) U1.24(VBUS)
CHG_VBUS_D: C7.1 Q1.3(G) Q3.3(D) R6.1
CHG_VBUS_G: Q3.1(G) R9.1 R11.2
ESP_USB_DM: J1.2(D-) U1.3(D-) ; port ESP_USB_DM  [project net EFM_USB_DM]
ESP_USB_DP: J1.3(D+) U1.2(D+) ; port ESP_USB_DP  [project net EFM_USB_DP]
I2C_SCL: U1.5(SCL) ; port I2C_SCL
I2C_SDA: U1.6(SDA) ; port I2C_SDA
PWR_CHG_INT: U1.7(INT) ; port PWR_CHG_INT
NetC8_2: C8.2 FB1.2 J1.1(VCC)
NetD1_2: D1.2(K) R1.2
NetFB2_2: FB2.2 J1.S1(SHIELD) J1.S2(SHIELD)

Not connected (* = marked no-connect by the designer): J1 4(ID)*; U1 22(REGN)

### Notes on the sheet
- POWER - CHARGER
- (in symbol BQ24195LRGER, part A) 1 of 2
- (in symbol BQ24195LRGER, part B) 2 of 2
- (in symbol TitleBlock1) Title; Size; Number; Rev.; INDUSTRIES; Date:; Sheet; of; File:; Drawn By:

### Library data of the parts
*#7 = TitleBlock1: HUCORP Title Block
C1-C4 = CL10A106MQ8NNNC: as C501 on sheet PWR_REGULATORS; Copyright: Copyright (C) 2022 Ultra Librarian. All rights reserved.; Manufacturer_Part_Number: CL10A106MQ8NNNC; Digi-Key_Part_Number_1: 1276-1119-2-ND; Digi-Key_Part_Number_2: 1276-1119-1-ND; Digi-Key_Part_Number_3: 1276-1119-6-ND; RefDes: RefDes
C5 = Cap: Capacitor; Published: 8-Jun-2000; LatestRevisionDate: 17-Jul-2002; LatestRevisionNote: Re-released for DXP Platform.; PackageReference: RAD-0.3; Publisher: Altium Limited; PackageDescription: Radial Cap, Thru-Hole; 2 Leads; 0.3 in Pin Spacing
C6 C9 = CL10A105KA8NNNC: as C502 on sheet PWR_REGULATORS; Copyright: Copyright (C) 2022 Ultra Librarian. All rights reserved.; Digi-Key_Part_Number_1: 1276-1006-2-ND; Digi-Key_Part_Number_2: 1276-1006-1-ND; Digi-Key_Part_Number_3: 1276-1006-6-ND; RefDes: RefDes; Value: 1uF
C7 = CL10B102KB8NFNC: CAP CER 1nF 50V X7R 0603; Mfr_Name: Samsung; Type: DEV; Copyright: Copyright (C) 2023 Ultra Librarian. All rights reserved.; Manufacturer_Part_Number: CL10B102KB8NFNC; Digi-Key_Part_Number_1: 1276-1914-2-ND; Digi-Key_Part_Number_2: 1276-1914-1-ND; Digi-Key_Part_Number_3: 1276-1914-6-ND; RefDes: RefDes
C8 C10 = CL10B104KA8NNNC: as C201 on sheet ESP8685H4; Copyright: Copyright (C) 2022 Ultra Librarian. All rights reserved.; Manufacturer_Part_Number: CL10B104KA8NNNC; Digi-Key_Part_Number_1: 1276-1006-2-ND; Digi-Key_Part_Number_2: 1276-1006-1-ND; Digi-Key_Part_Number_3: 1276-1006-6-ND; RefDes: RefDes
D1 = LED0: Typical INFRARED GaAs LED; Published: 8-Jun-2000; LatestRevisionDate: 08-Jul-2005; LatestRevisionNote: Mech Layer 1 removed.; PackageReference: LED-0; Publisher: Altium Limited; PackageDescription: LED; 2 Leads
FB1 = 2506033007Y3: FERRITE BEAD 30 OHM 0603 1LN; Mfr_Name: Fair-Rite; Type: DEV; Copyright: Copyright (C) 2023 Ultra Librarian. All rights reserved.; Manufacturer_Part_Number: 2506033007Y3; Digi-Key_Part_Number_1: 1934-1439-1-ND; Digi-Key_Part_Number_2: 1934-1439-2-ND; Digi-Key_Part_Number_3: 1934-1439-6-ND; RefDes: RefDes
FB2 = MMZ1608Q102BTA00: FERRITE BEAD 1K OHM 0603 1LN; Mfr_Name: TDK; Type: DEV; Copyright: Copyright (C) 2023 Ultra Librarian. All rights reserved.; Manufacturer_Part_Number: MMZ1608Q102BTA00; Digi-Key_Part_Number_1: 445-8680-1-ND; Digi-Key_Part_Number_2: 445-8680-2-ND; Digi-Key_Part_Number_3: 445-8680-6-ND; RefDes: RefDes
J1 = USB3131-30-0230-A_REVB: USB - micro B USB 2.0 Receptacle Connector 5 Position Through Hole; Availability: Unavailable; MP: USB3131-30-0230-A_REVB; Value: *; Package: None; Price: None
L1 = DFE252010P-2R2M=P2: Inductor with Inductance: 2.2uH Tol. +/-20%, Package: 1008 (2520); MF: Murata Electronics; MP: DFE252010P-2R2M=P2; Purchase-URL: https://pricing.snapeda.com/search/part/DFE252010P-2R2M=P2/?ref=eda; Check_prices: https://www.snapeda.com/parts/DFE252010P-2R2M=P2/Murata%20Electronics%20North%20America/view-part/1503972/?ref=eda; Package: 2520 Murata; Availability: Warning; Price: None; SnapEDA_Link: https://www.snapeda.com/parts/DFE252010P-2R2M=P2/Murata%20Electronics%20North%20America/view-part/1503972/?ref=snap
Q1 = CSD25310Q2T: -20V, P ch NexFET MOSFET, single SON 2x2, 23.9mOhm 6-WSON -55 to 150; MF: Texas Instruments; Digi-Key_Part_Number: 296-50290-2-ND; Value: *; Package: WSON-6 Texas Instruments; Purchase-URL: https://pricing.snapeda.com/search/part/CSD25310Q2T/?ref=eda; Check_prices: https://www.snapeda.com/parts/CSD25310Q2T/Texas+Instruments/view-part/?ref=eda; MP: CSD25310Q2T; SnapEDA_Link: https://www.snapeda.com/parts/CSD25310Q2T/Texas+Instruments/view-part/?ref=snap
Q2 Q3 = SI2312BDS-T1-E3: N-Channel 20 V (D-S) MOSFET; Manufacturer_Name: Vishay; Geometry.Height: 1.12mm; Mouser Part Number: 781-SI2312BDS-E3; Mouser Price/Stock: https://www.mouser.co.uk/ProductDetail/Vishay-Semiconductors/SI2312BDS-T1-E3?qs=jcx%252B0HVgj2b3YhM4OoQ%252BrQ%3D%3D; Manufacturer_Part_Number: SI2312BDS-T1-E3; Datasheet Link: http://www.vishay.com/docs/73235/si2312bds.pdf
R1 = RC0603FR-072K2L: RES 2.2K OHM 1% 1/10W 0603; Mfr_Name: Yageo; Copyright: Copyright (C) 2023 Ultra Librarian. All rights reserved.; Manufacturer_Part_Number: RC0603FR-072K2L; Digi-Key_Part_Number_1: 311-2.20KHRCT-ND; Digi-Key_Part_Number_2: 311-2.20KHRDKR-ND; Digi-Key_Part_Number_3: 311-2.20KHRTR-ND; Digi-Key_Part_Number_4: 311-2.20KHRTR-NDL; RefDes: RefDes; Type: DEV
R2 = RC0603FR-13330RL: RES 330 OHM 1% 1/10W 0603; Mfr_Name: Yageo; Copyright: Copyright (C) 2023 Ultra Librarian. All rights reserved.; Manufacturer_Part_Number: RC0603FR-13330RL; Digi-Key_Part_Number_1: 13-RC0603FR-13330RLTR-ND; Digi-Key_Part_Number_2: 13-RC0603FR-13330RLCT-ND; Digi-Key_Part_Number_3: 13-RC0603FR-13330RLDKR-ND; RefDes: RefDes; Type: DEV
R3 = RC0603FR-075K49L: RES 5.49K OHM 1% 1/10W 0603; Mfr_Name: Yageo; Copyright: Copyright (C) 2023 Ultra Librarian. All rights reserved.; Manufacturer_Part_Number: RC0603FR-075K49L; Digi-Key_Part_Number_1: 311-5.49KHRCT-ND; Digi-Key_Part_Number_2: 311-5.49KHRDKR-ND; Digi-Key_Part_Number_3: 311-5.49KHRTR-ND; RefDes: RefDes; Type: DEV
R4 = RT0603DRE0731K2L: RES 31.2K OHM 0.5% 1/10W 0603; Package: None; Price: None; MP: RT0603DRE0731K2L; Availability: Unavailable
R5 R6 R8 R12 = RC0603JR-1310KL: as R201 on sheet ESP8685H4; Copyright: Copyright (C) 2022 Ultra Librarian. All rights reserved.; Manufacturer_Part_Number: RC0603JR-1310KL; Digi-Key_Part_Number_1: 13-RC0603JR-1310KLTR-ND; Digi-Key_Part_Number_2: 13-RC0603JR-1310KLCT-ND; Digi-Key_Part_Number_3: 13-RC0603JR-1310KLDKR-ND; RefDes: RefDes; Type: DEV; Value: 10K
R7 = RC0603FR-07121KL: RES 121K OHM 1% 1/10W 0603; Mfr_Name: Yageo; Copyright: Copyright (C) 2023 Ultra Librarian. All rights reserved.; Manufacturer_Part_Number: RC0603FR-07121KL; Digi-Key_Part_Number_1: 311-121KHRCT-ND; Digi-Key_Part_Number_2: 311-121KHRDKR-ND; Digi-Key_Part_Number_3: 311-121KHRTR-ND; RefDes: RefDes; Type: DEV
R9 = RC0603FR-07261KL: RES 261K OHM 1% 1/10W 0603; Mfr_Name: Yageo; Copyright: Copyright (C) 2023 Ultra Librarian. All rights reserved.; Manufacturer_Part_Number: RC0603FR-07261KL; Digi-Key_Part_Number_1: 311-261KHRCT-ND; Digi-Key_Part_Number_2: 311-261KHRDKR-ND; Digi-Key_Part_Number_3: 311-261KHRTR-ND; RefDes: RefDes; Type: DEV
R10 = RC0603FR-1049K9L: RES 49.9K OHM 1% 1/10W 0603; Mfr_Name: Yageo; Copyright: Copyright (C) 2023 Ultra Librarian. All rights reserved.; Manufacturer_Part_Number: RC0603FR-1049K9L; Digi-Key_Part_Number_1: 13-RC0603FR-1049K9LTR-ND; Digi-Key_Part_Number_2: 13-RC0603FR-1049K9LCT-ND; Digi-Key_Part_Number_3: 13-RC0603FR-1049K9LDKR-ND; RefDes: RefDes; Type: DEV
R11 = RC0603FR-07100KL: RES 100K OHM 1% 1/10W 0603; Mfr_Name: Yageo; Copyright: Copyright (C) 2022 Ultra Librarian. All rights reserved.; Manufacturer_Part_Number: RC0603FR-07100KL; Digi-Key_Part_Number_1: 311-100KHRCT-ND; Digi-Key_Part_Number_2: 311-100KHRDKR-ND; Digi-Key_Part_Number_3: 311-100KHRTR-ND; Digi-Key_Part_Number_4: 311-100KHRTR-NDL; RefDes: RefDes; Type: DEV; Value: 100K
U1 = BQ24195LRGER: IC BATT CHG LI-ION 1CELL 24VQFN; Mfr_Name: Texas Instruments; Copyright: Copyright (C) 2023 Ultra Librarian. All rights reserved.; Manufacturer_Part_Number: BQ24195LRGER; Digi-Key_Part_Number_1: 2156-BQ24195LRGER-ND; Digi-Key_Part_Number_2: 296-49149-1-ND; Digi-Key_Part_Number_3: 296-49149-2-ND; Digi-Key_Part_Number_4: 296-49149-6-ND; Digi-Key_Part_Number_5: BQ24195LRGER-ND; RefDes: RefDes; Type: DEV

## Nets that join several sheets
GND: ESP8685H4 (C201.1 C202.1 C203.1 U201.25), PWR_REGULATORS (6 pins), TLV320DAC3100 (20 pins), PWR_FG (8 pins), PWR_CHGR (21 pins)
VCC_3V3: ESP8685H4 (12 pins), PWR_REGULATORS (C502.2 TP501.1 U501.5), TLV320DAC3100 (7 pins), PWR_FG (R701.2)
VSYS: PWR_REGULATORS (5 pins), PWR_FG (8 pins), PWR_CHGR (C4.2 R8.2 U1.13 U1.14)
1V8_EN: ESP8685H4 (U202.8), PWR_REGULATORS (U502.3)
EFM_USB_DM: ESP8685H4 (U202.18), PWR_CHGR (J1.2 U1.3)
EFM_USB_DP: ESP8685H4 (U202.26), PWR_CHGR (J1.3 U1.2)
I2C_SCL: ESP8685H4 (R201.1 U202.15), TLV320DAC3100 (U2.10), PWR_FG (U701.2), PWR_CHGR (U1.5)
I2C_SDA: ESP8685H4 (R202.1 U202.14), TLV320DAC3100 (U2.9), PWR_FG (U701.1), PWR_CHGR (U1.6)
PWR_CHG_INT: ESP8685H4 (U202.16), PWR_CHGR (U1.7)
PWR_FG_INT: ESP8685H4 (U202.6), PWR_FG (R701.1 U701.12)